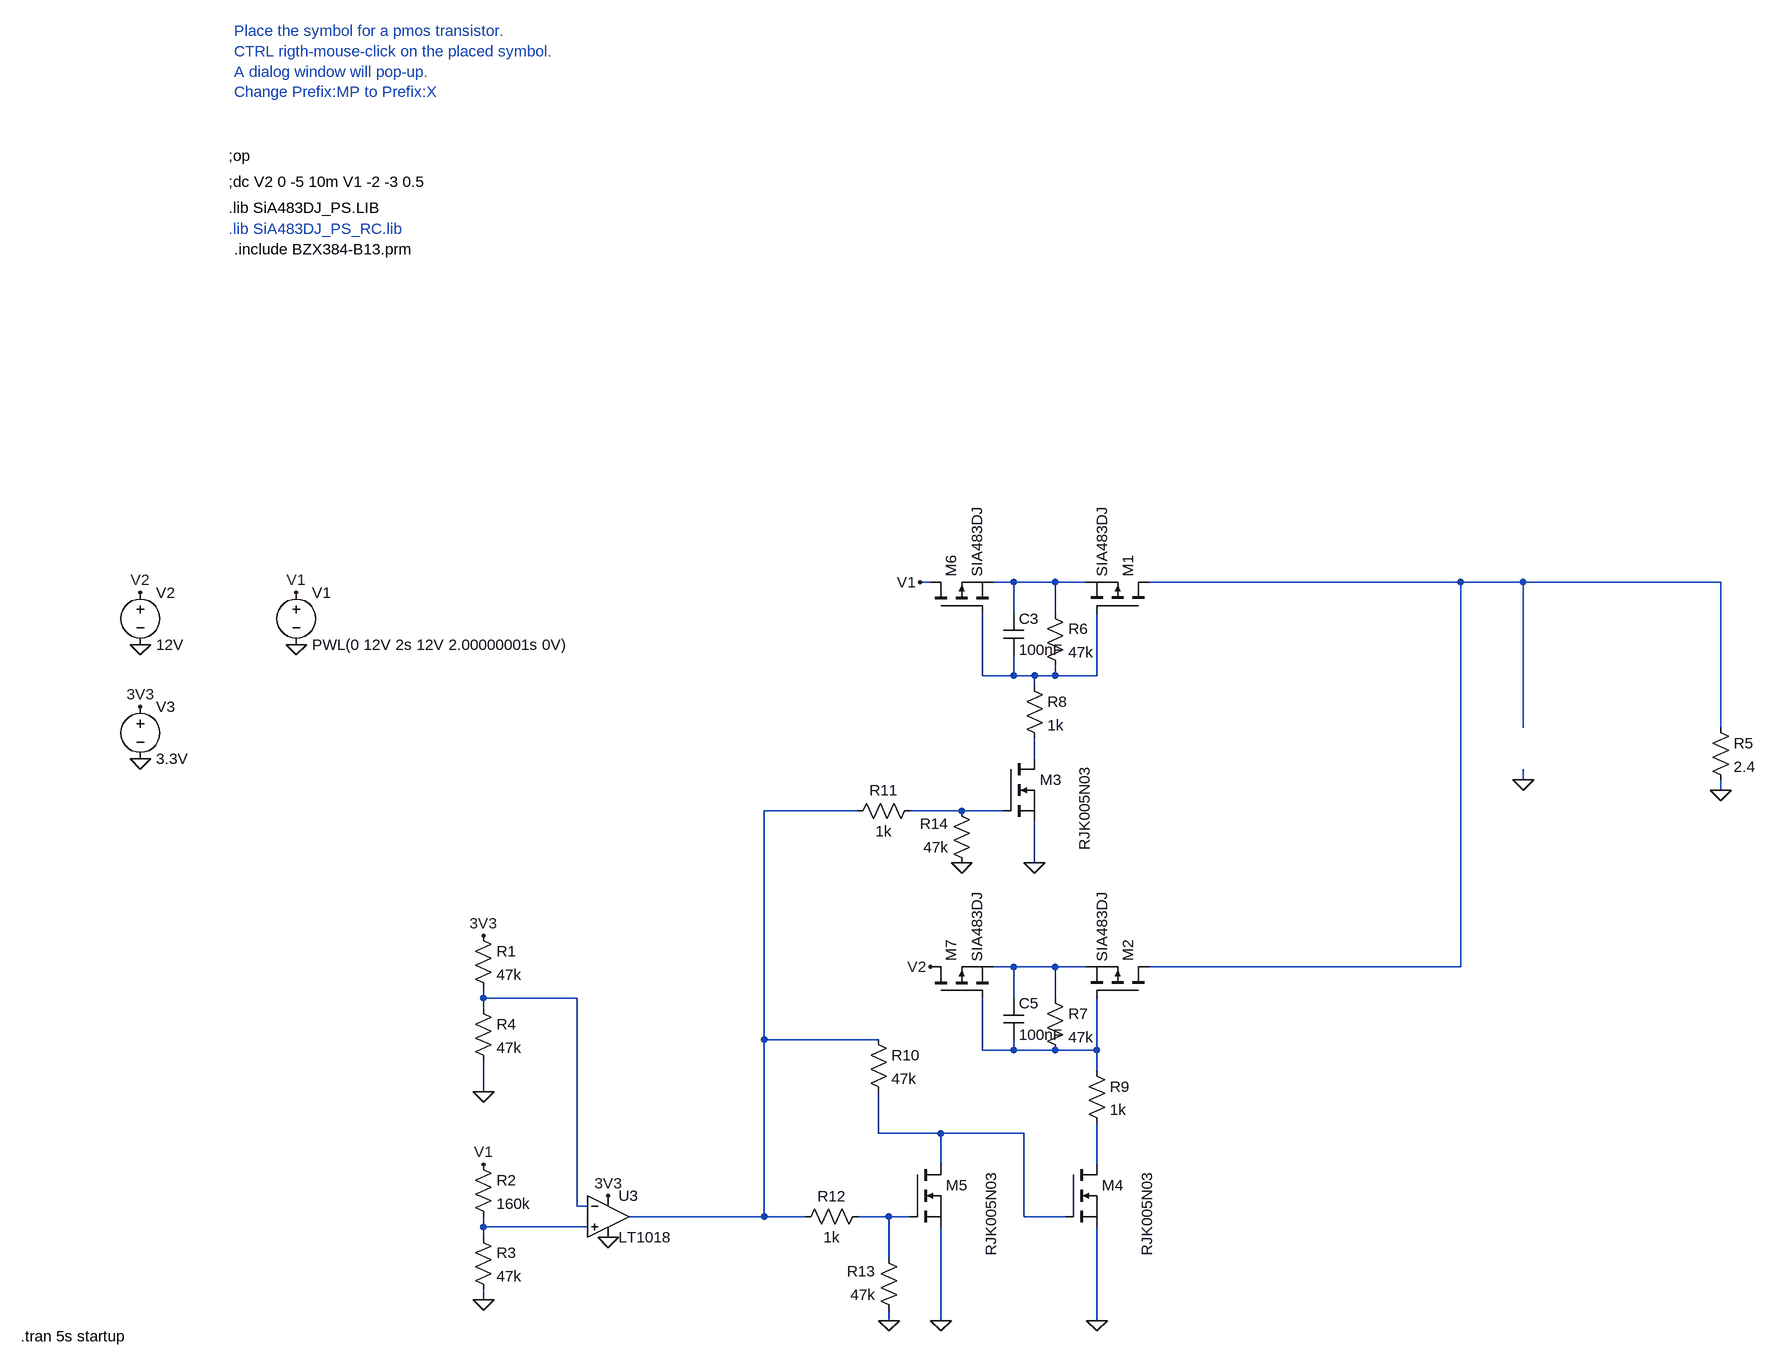
[diagram p0: schematic PowerMux.asc]
PowerMux.asc, the LTspice schematic file:
Version 4
SHEET 1 2412 1560
WIRE 1136 384 1120 384
WIRE 1264 384 1232 384
WIRE 1328 384 1264 384
WIRE 1376 384 1328 384
WIRE 1952 384 1472 384
WIRE 2048 384 1952 384
WIRE 2352 384 2048 384
WIRE 1264 432 1264 384
WIRE 1328 432 1328 384
WIRE 1216 528 1216 432
WIRE 1264 528 1264 496
WIRE 1264 528 1216 528
WIRE 1296 528 1264 528
WIRE 1328 528 1328 512
WIRE 1328 528 1296 528
WIRE 1392 528 1392 432
WIRE 1392 528 1328 528
WIRE 1296 544 1296 528
WIRE 2048 608 2048 384
WIRE 2352 608 2352 384
WIRE 1296 656 1296 624
WIRE 2048 688 2048 672
WIRE 2352 704 2352 688
WIRE 1024 736 880 736
WIRE 1184 736 1104 736
WIRE 1248 736 1184 736
WIRE 1296 816 1296 752
WIRE 1264 976 1232 976
WIRE 1328 976 1264 976
WIRE 1376 976 1328 976
WIRE 1952 976 1952 384
WIRE 1952 976 1472 976
WIRE 448 1024 448 1008
WIRE 592 1024 448 1024
WIRE 1264 1024 1264 976
WIRE 1328 1024 1328 976
WIRE 448 1040 448 1024
WIRE 880 1088 880 736
WIRE 1056 1088 880 1088
WIRE 1216 1104 1216 1024
WIRE 1264 1104 1264 1088
WIRE 1264 1104 1216 1104
WIRE 1328 1104 1264 1104
WIRE 1392 1104 1392 1024
WIRE 1392 1104 1328 1104
WIRE 1392 1136 1392 1104
WIRE 448 1168 448 1120
WIRE 1056 1232 1056 1168
WIRE 1152 1232 1056 1232
WIRE 1280 1232 1152 1232
WIRE 1152 1280 1152 1232
WIRE 1392 1280 1392 1216
WIRE 592 1344 592 1024
WIRE 608 1344 592 1344
WIRE 880 1360 880 1088
WIRE 880 1360 672 1360
WIRE 944 1360 880 1360
WIRE 1072 1360 1024 1360
WIRE 1104 1360 1072 1360
WIRE 1280 1360 1280 1232
WIRE 1344 1360 1280 1360
WIRE 448 1376 448 1360
WIRE 608 1376 448 1376
WIRE 448 1392 448 1376
WIRE 1072 1424 1072 1360
WIRE 448 1488 448 1472
WIRE 1072 1520 1072 1504
WIRE 1152 1520 1152 1376
WIRE 1392 1520 1392 1376
FLAG 448 1488 0
FLAG 640 1392 0
FLAG -80 480 0
FLAG 160 480 0
FLAG 160 400 V1
FLAG -80 400 V2
FLAG 448 1280 V1
FLAG 448 1168 0
FLAG 2352 704 0
FLAG 2048 688 0
FLAG 1184 816 0
FLAG 1296 816 0
FLAG 1072 1520 0
FLAG 1152 1520 0
FLAG 1392 1520 0
FLAG 1120 384 V1
FLAG 1136 976 V2
FLAG -80 656 0
FLAG -80 576 3V3
FLAG 448 928 3V3
FLAG 640 1328 3V3
SYMBOL pmos 1472 432 M270
SYMATTR InstName M1
SYMATTR Value SIA483DJ
SYMATTR Prefix X
SYMBOL nmos 1248 656 R0
WINDOW 3 125 141 VLeft 2
SYMATTR Value RJK005N03
SYMATTR InstName M3
SYMBOL res 432 1264 R0
SYMATTR InstName R2
SYMATTR Value 160k
SYMBOL res 432 1376 R0
SYMATTR InstName R3
SYMATTR Value 47k
SYMBOL voltage 160 384 R0
WINDOW 123 0 0 Left 0
WINDOW 39 0 0 Left 0
SYMATTR InstName V1
SYMATTR Value PWL(0 12V 2s 12V 2.00000001s 0V)
SYMBOL voltage -80 384 R0
WINDOW 123 0 0 Left 0
WINDOW 39 0 0 Left 0
SYMATTR InstName V2
SYMATTR Value 12V
SYMBOL res 432 912 R0
SYMATTR InstName R1
SYMATTR Value 47k
SYMBOL res 432 1024 R0
SYMATTR InstName R4
SYMATTR Value 47k
SYMBOL nmos 1344 1280 R0
WINDOW 3 125 141 VLeft 2
SYMATTR Value RJK005N03
SYMATTR InstName M4
SYMBOL res 2336 592 R0
SYMATTR InstName R5
SYMATTR Value 2.4
SYMBOL nmos 1104 1280 R0
WINDOW 3 125 141 VLeft 2
SYMATTR Value RJK005N03
SYMATTR InstName M5
SYMBOL res 1312 416 R0
SYMATTR InstName R6
SYMATTR Value 47k
SYMBOL pmos 1136 432 R270
SYMATTR InstName M6
SYMATTR Value SIA483DJ
SYMATTR Prefix X
SYMBOL cap 1248 432 R0
SYMATTR InstName C3
SYMATTR Value 100nF
SYMBOL res 1280 528 R0
SYMATTR InstName R8
SYMATTR Value 1k
SYMBOL pmos 1472 1024 M270
SYMATTR InstName M2
SYMATTR Value SIA483DJ
SYMATTR Prefix X
SYMBOL res 1312 1008 R0
SYMATTR InstName R7
SYMATTR Value 47k
SYMBOL pmos 1136 1024 R270
SYMATTR InstName M7
SYMATTR Value SIA483DJ
SYMATTR Prefix X
SYMBOL cap 1248 1024 R0
SYMATTR InstName C5
SYMATTR Value 100nF
SYMBOL res 1376 1120 R0
SYMATTR InstName R9
SYMATTR Value 1k
SYMBOL res 1040 1072 R0
SYMATTR InstName R10
SYMATTR Value 47k
SYMBOL res 1120 720 R90
WINDOW 0 0 56 VBottom 2
WINDOW 3 32 56 VTop 2
SYMATTR InstName R11
SYMATTR Value 1k
SYMBOL res 1040 1344 R90
WINDOW 0 0 56 VBottom 2
WINDOW 3 32 56 VTop 2
SYMATTR InstName R12
SYMATTR Value 1k
SYMBOL res 1088 1520 R180
WINDOW 0 36 76 Left 2
WINDOW 3 36 40 Left 2
SYMATTR InstName R13
SYMATTR Value 47k
SYMBOL res 1200 832 R180
WINDOW 0 36 76 Left 2
WINDOW 3 36 40 Left 2
SYMATTR InstName R14
SYMATTR Value 47k
SYMBOL Comparators\\LT1018 640 1360 R0
SYMATTR InstName U3
SYMBOL voltage -80 560 R0
WINDOW 123 0 0 Left 0
WINDOW 39 0 0 Left 0
SYMATTR InstName V3
SYMATTR Value 3.3V
TEXT 56 -232 Left 2 !;dc V2 0 -5 10m V1 -2 -3 0.5
TEXT 56 -192 Left 2 !.lib SiA483DJ_PS.LIB
TEXT 56 -160 Left 2 ;.lib SiA483DJ_PS_RC.lib
TEXT 56 -272 Left 2 !;op
TEXT 64 -464 Left 2 ;Place the symbol for a pmos transistor.\nCTRL rigth-mouse-click on the placed symbol.\nA dialog window will pop-up.\nChange Prefix:MP to Prefix:X
TEXT 64 -128 Left 2 !.include BZX384-B13.prm
TEXT -264 1544 Left 2 !.tran 5s startup

The netlist it stands for:
* PowerMux.asc
XM1 N002 N003 N001 SIA483DJ  ; pins D G S
M3 N004 N006 0 0 RJK005N03
R2 V1 N013 160k
R3 N013 0 47k
V1 V1 0 PWL(0 12V 2s 12V 2.00000001s 0V)
V2 V2 0 12V
R1 3V3 N008 47k
R4 N008 0 47k
M4 N011 N010 0 0 RJK005N03
R5 N002 0 2.4
M5 N010 N012 0 0 RJK005N03
R6 N001 N003 47k
XM6 V1 N003 N001 SIA483DJ  ; pins D G S
C3 N001 N003 100nF
R8 N003 N004 1k
XM2 N002 N009 N007 SIA483DJ  ; pins D G S
R7 N007 N009 47k
XM7 V2 N009 N007 SIA483DJ  ; pins D G S
C5 N007 N009 100nF
R9 N009 N011 1k
R10 N005 N010 47k
R11 N006 N005 1k
R12 N012 N005 1k
R13 0 N012 47k
R14 0 N006 47k
XU3 N013 N008 3V3 0 N005 LT1018  ; pins In+ In- V+ V- OUT
V3 3V3 0 3.3V
.model NMOS NMOS
.model PMOS PMOS
.lib standard.mos
;dc V2 0 -5 10m V1 -2 -3 0.5
.lib SiA483DJ_PS.LIB
* .lib SiA483DJ_PS_RC.lib
;op
* Place the symbol for a pmos transistor.
* CTRL rigth-mouse-click on the placed symbol.
* A dialog window will pop-up.
* Change Prefix:MP to Prefix:X
.include BZX384-B13.prm
.tran 5s startup
.lib LTC1.lib
.backanno
.end